# EAGLE design untitled (EAGLE 7.7.0)
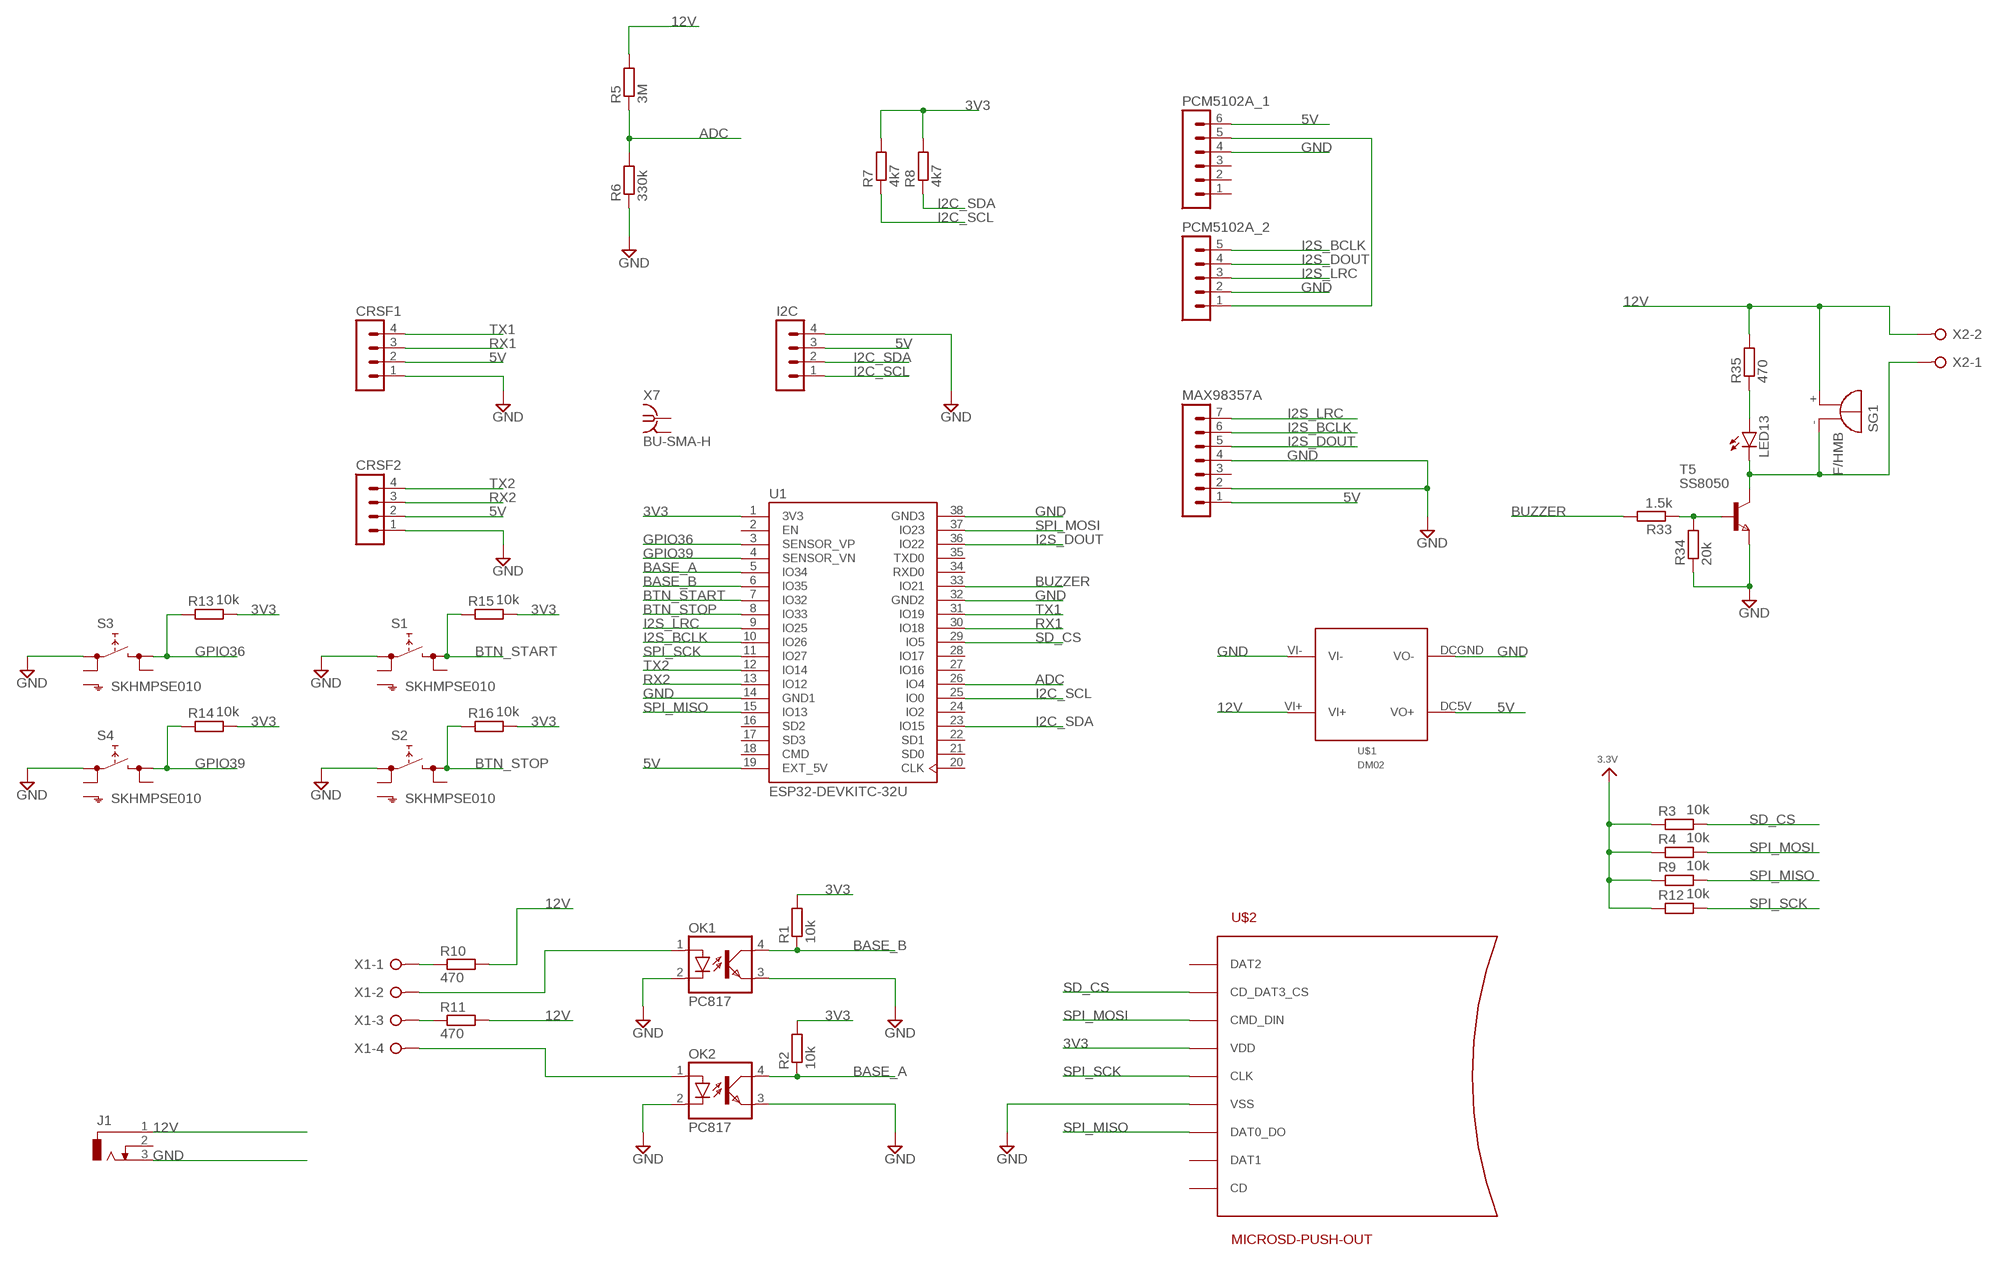
[diagram p0: schematic, sheet 1]

## Parts
CRSF1  MA04-1  [MA04-1]
CRSF2  MA04-1  [MA04-1]
I2C  MA04-1  [MA04-1]
J1  DCJ0303  [DCJ0303]
LED13  LEDCHIPLED_0805  [CHIPLED_0805]
MAX98357A  MA07-1  [MA07-1]
OK1  PC817  [DIL04]
OK2  PC817  [DIL04]
PCM5102A_1  MA06-1  [MA06-1]
PCM5102A_2  MA05-1  [MA05-1]
R1  10k  R-EU_R0603  [R0603]
R2  10k  R-EU_R0603  [R0603]
R3  10k  R-EU_R0603  [R0603]
R4  10k  R-EU_R0603  [R0603]
R5  3M  R-EU_R0603  [R0603]
R6  330k  R-EU_R0603  [R0603]
R7  4k7  R-EU_R0603  [R0603]
R8  4k7  R-EU_R0603  [R0603]
R9  10k  R-EU_R0603  [R0603]
R10  470  R-EU_R0603  [R0603]
R11  470  R-EU_R0603  [R0603]
R12  10k  R-EU_R0603  [R0603]
R13  10k  R-EU_R0603  [R0603]
R14  10k  R-EU_R0603  [R0603]
R15  10k  R-EU_R0603  [R0603]
R16  10k  R-EU_R0603  [R0603]
R33  1.5k  R-EU_R0603  [R0603]
R34  20k  R-EU_R0603  [R0603]
R35  470  R-EU_R0603  [R0603]
S1  SKHMPSE010  [SKHMPXE010]
S2  SKHMPSE010  [SKHMPXE010]
S3  SKHMPSE010  [SKHMPXE010]
S4  SKHMPSE010  [SKHMPXE010]
SG1  F/HMB  [F/HMB]
T5  SS8050  NPNSOT23  [SOT-23]
U1  ESP32-DEVKITC-32U  [MODULE_ESP32-DEVKITC-32U]
U$1  DM02  [DM02]
U$2  MICROSD-PUSH-OUT  [MICROSD-PUSH-OUT]
X1  W237-04P  [W237-4P]
X2  W237-02P  [W237-132]
X7  BU-SMA-H  [BU-SMA-H]

## Nets
3.3V: R3.1 R4.1 R9.1 R12.1
3V3: R1.2 R2.2 R7.2 R8.2 R13.2 R14.2 R15.2 R16.2 U1.1(3V3) U$2.4(VDD)
5V: CRSF1.2 CRSF2.2 I2C.3 MAX98357A.1 PCM5102A_1.6 U1.19(EXT_5V) U$1.DC5V(VO+)
12V: J1.1 R5.2 R10.2 R11.2 R35.2 SG1.+ U$1.VI+ X2.2
ADC: R5.1 R6.2 U1.26(IO4)
BASE_A: OK2.4(COL) R2.1 U1.5(IO34)
BASE_B: OK1.4(COL) R1.1 U1.6(IO35)
BTN_START: R15.1 S1.3(2.1) U1.7(IO32)
BTN_STOP: R16.1 S2.3(2.1) U1.8(IO33)
BUZZER: R33.2 U1.33(IO21)
GND: CRSF1.1 CRSF2.1 I2C.4 J1.3 MAX98357A.2 MAX98357A.4 OK1.2(C) OK1.3(EMIT) OK2.2(C) OK2.3(EMIT) PCM5102A_1.4 PCM5102A_2.2 R6.1 R34.1 S1.1(1.1) S2.1(1.1) S3.1(1.1) S4.1(1.1) T5.2(E) U1.14(GND1) U1.32(GND2) U1.38(GND3) U$1.DCGND(VO-) U$1.VI- U$2.6(VSS) U$2.G1(VSS) U$2.G2(VSS) U$2.G3(VSS) U$2.G4(VSS)
GPIO36: R13.1 S3.3(2.1) U1.3(SENSOR_VP)
GPIO39: R14.1 S4.3(2.1) U1.4(SENSOR_VN)
I2C_SCL: I2C.1 R7.1 U1.25(IO0)
I2C_SDA: I2C.2 R8.1 U1.23(IO15)
I2S_BCLK: MAX98357A.6 PCM5102A_2.5 U1.10(IO26)
I2S_DOUT: MAX98357A.5 PCM5102A_2.4 U1.36(IO22)
I2S_LRC: MAX98357A.7 PCM5102A_2.3 U1.9(IO25)
N$1: OK1.1(A) X1.2
N$2: OK2.1(A) X1.4
N$3: PCM5102A_1.5 PCM5102A_2.1
N$24: R10.1 X1.1
N$30: R11.1 X1.3
N$59: R33.1 R34.2 T5.3(B)
N$61: LED13.A R35.1
N$62: LED13.C SG1.- T5.1(C) X2.1
RX1: CRSF1.3 U1.30(IO18)
RX2: CRSF2.3 U1.13(IO12)
SD_CS: R3.2 U1.29(IO5) U$2.2(CD_DAT3_CS)
SPI_MISO: R9.2 U1.15(IO13) U$2.7(DAT0_DO)
SPI_MOSI: R4.2 U1.37(IO23) U$2.3(CMD_DIN)
SPI_SCK: R12.2 U1.11(IO27) U$2.5(CLK)
TX1: CRSF1.4 U1.31(IO19)
TX2: CRSF2.4 U1.12(IO14)
Unconnected: J1.2 MAX98357A.3 PCM5102A_1.1 PCM5102A_1.2 PCM5102A_1.3 S1.2(1.2) S1.4(2.2) S1.5(SH) S2.2(1.2) S2.4(2.2) S2.5(SH) S3.2(1.2) S3.4(2.2) S3.5(SH) S4.2(1.2) S4.4(2.2) S4.5(SH) U1.2(EN) U1.16(SD2) U1.17(SD3) U1.18(CMD) U1.20(CLK) U1.21(SD0) U1.22(SD1) U1.24(IO2) U1.27(IO16) U1.28(IO17) U1.34(RXD0) U1.35(TXD0) U$2.1(DAT2) U$2.8(DAT1) U$2.CD X7.1 X7.2 X7.3 X7.4 X7.5

## Library data of the parts
CRSF1 CRSF2 I2C = con-lstb:MA04-1: PIN HEADER; OC_FARNELL: unknown; OC_NEWARK: unknown
J1 = con-jack:DCJ0303: DC POWER JACK Source: DCJ0303.pdf; OC_FARNELL: unknown; OC_NEWARK: unknown
LED13 = led:LED: LED OSRAM: - CHIPLED LG R971, LG N971, LY N971, LG Q971, LY Q971, LO R971, LY R971 LH N974, LH R974 LS Q976, LO Q976, LY Q976 LO Q996 - Hyper CHIPLED LW Q18S LB Q993, LB Q99A, LB R99A - SideLED LS A670, LO A670, LY A670, LG A670, LP A670 LB A673, LV A673, LT A673, LW A673 LH A674 LY A675 LS A676, LA A676, LO A676, LY A676, LW A676 LS A679, LY A679, LG A679 - Hyper Micro SIDELED® LS Y876, LA Y876, LO Y876, LY Y876 LT Y87S - SmartLED LW L88C, LW L88S LB L89C, LB L89S, LG L890 LS L89K, LO L89K, LY L89K LS L896, LA L896, LO L896, LY L896 - TOPLED LS T670, LO T670, LY T670, LG T670, LP T670 LSG T670, LSP T670, LSY T670, LOP T670, LYG T670 LG T671, LOG T671, LSG T671 LB T673, LV T673, LT T673, LW T673 LH T674 LS T676, LA T676, LO T676, LY T676, LB T676, LH T676, LSB T676, LW T676 LB T67C, LV T67C, LT T67C, LS T67K, LO T67K, LY T67K, LW E67C LS E67B, LA E67B, LO E67B, LY E67B, LB E67C, LV E67C, LT E67C LW T67C LS T679, LY T679, LG T679 LS T770, LO T770, LY T770, LG T770, LP T770 LB T773, LV T773, LT T773, LW T773 LH T774 LS E675, LA E675, LY E675, LS T675 LS T776, LA T776, LO T776, LY T776, LB T776 LHGB T686 LT T68C, LB T68C - Hyper Mini TOPLED® LB M676 - Mini TOPLED Santana® LG M470 LS M47K, LO M47K, LY M47K Source: http://www.osram.convergy.de LUXEON: - LUMILED® LXK2-PW12-R00, LXK2-PW12-S00, LXK2-PW14-U00, LXK2-PW14-V00 LXK2-PM12-R00, LXK2-PM12-S00, LXK2-PM14-U00 LXK2-PE12-Q00, LXK2-PE12-R00, LXK2-PE12-S00, LXK2-PE14-T00, LXK2-PE14-U00 LXK2-PB12-K00, LXK2-PB12-L00, LXK2-PB12-M00, LXK2-PB14-N00, LXK2-PB14-P00, LXK2-PB14-Q00 LXK2-PR12-L00, LXK2-PR12-M00, LXK2-PR14-Q00, LXK2-PR14-R00 LXK2-PD12-Q00, LXK2-PD12-R00, LXK2-PD12-S00 LXK2-PH12-R00, LXK2-PH12-S00 LXK2-PL12-P00, LXK2-PL12-Q00, LXK2-PL12-R00 Source: www.luxeon.com KINGBRIGHT: KA-3528ASYC Source: www.kingbright.com
MAX98357A = con-lstb:MA07-1: PIN HEADER; OC_FARNELL: unknown; OC_NEWARK: unknown
OK1 OK2 = optocoupler:PC817: SHARP OPTO COUPLER; MPN: PC817X4J000F; OC_FARNELL: 9707727; OC_NEWARK: 97K7059
PCM5102A_1 = con-lstb:MA06-1: PIN HEADER; OC_FARNELL: unknown; OC_NEWARK: unknown
PCM5102A_2 = con-lstb:MA05-1: PIN HEADER; OC_FARNELL: unknown; OC_NEWARK: unknown
R1-R16 R33-R35 = rcl:R-EU_: RESISTOR, European symbol; SPICEPREFIX: R
S1-S4 = switch:SKHMP*E010: 6.2 X 6.5mm TACT Switch (SMD) Source: http://www3.alps.co.jp/WebObjects/catalog.woa/PDF/E/Switch/Tact/SKHM/SKHM.PDF
SG1 = buzzer:F/HMB: BUZZER Source: Buerklin; OC_FARNELL: unknown; OC_NEWARK: unknown
T5 = zetex:NPNSOT23: NPN TRANSISTOR; MPN: DSS20201L-7; OC_FARNELL: 1710688; OC_NEWARK: 25R4555
U1 = ESP32-DEVKITC-32U:ESP32-DEVKITC-32U: Check availability <https://pricing.snapeda.com/parts/ESP32-DEVKITC-32U/Espressif%20Systems/view-part?ref=eda>; AVAILABILITY: In Stock; CHECK_PRICES: https://www.snapeda.com/parts/ESP32-DEVKITC-32U/Espressif+Systems/view-part/?ref=eda; DESCRIPTION: ESP32-WROOM-32UE series Transceiver; 802.11 b/g/n (Wi-Fi, WiFi, WLAN), Bluetooth® Smart Ready 4.x Dual Mode Evaluation Board; MF: Espressif Systems; MP: ESP32-DEVKITC-32U; PACKAGE: CUSTOM-38 ESPRESSIF; PRICE: None; SNAPEDA_LINK: https://www.snapeda.com/parts/ESP32-DEVKITC-32U/Espressif+Systems/view-part/?ref=snap
U$1 = dm02:DM02
U$2 = microsd:MICROSD-PUSH-OUT: T-Flash Push-Out Micro SD Card Reader 14.75mm x 14.5mm SMD with external pins
X1 = con-wago-508:W237-04P: WAGO SREW CLAMP; OC_FARNELL: unknown; OC_NEWARK: unknown
X2 = con-wago-508:W237-02P: WAGO SREW CLAMP; OC_FARNELL: unknown; OC_NEWARK: unknown
X7 = con-coax:BU-SMA-H: FEMALE SMA CONNECTOR Radiall; OC_FARNELL: unknown; OC_NEWARK: unknown

## Board
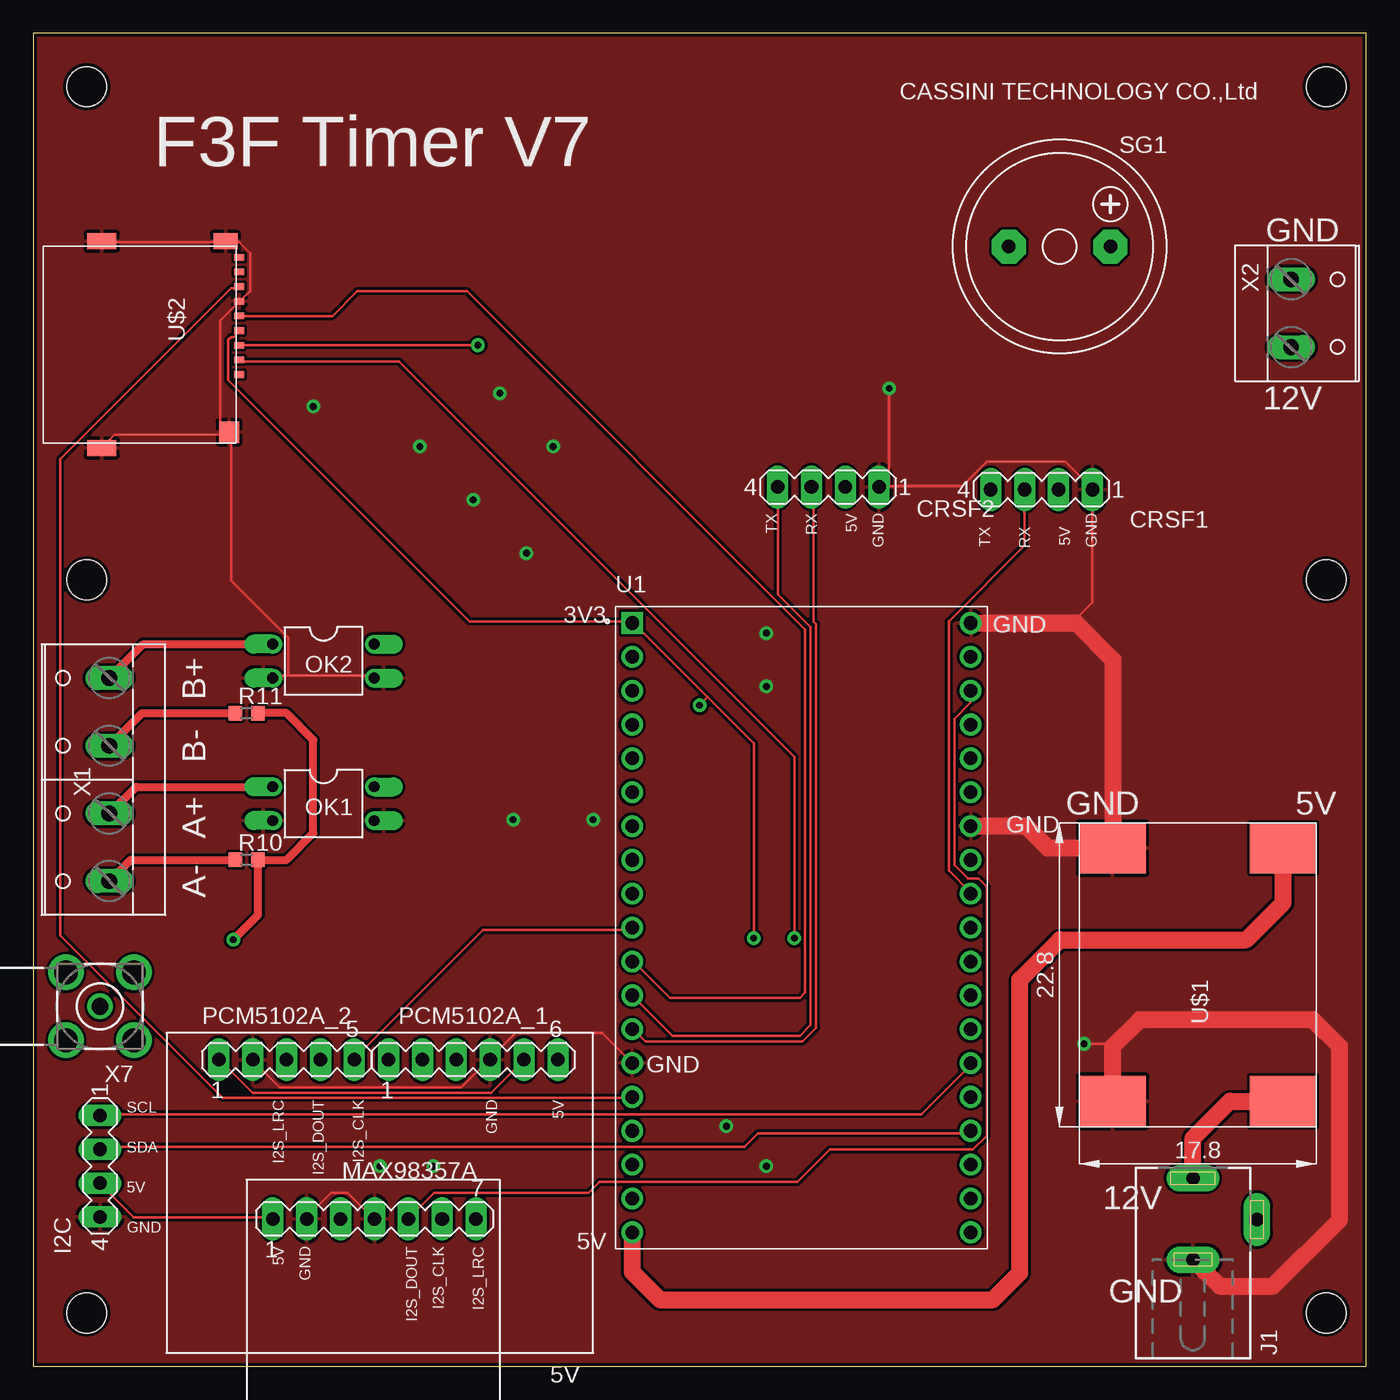
[diagram p1: board, top side]
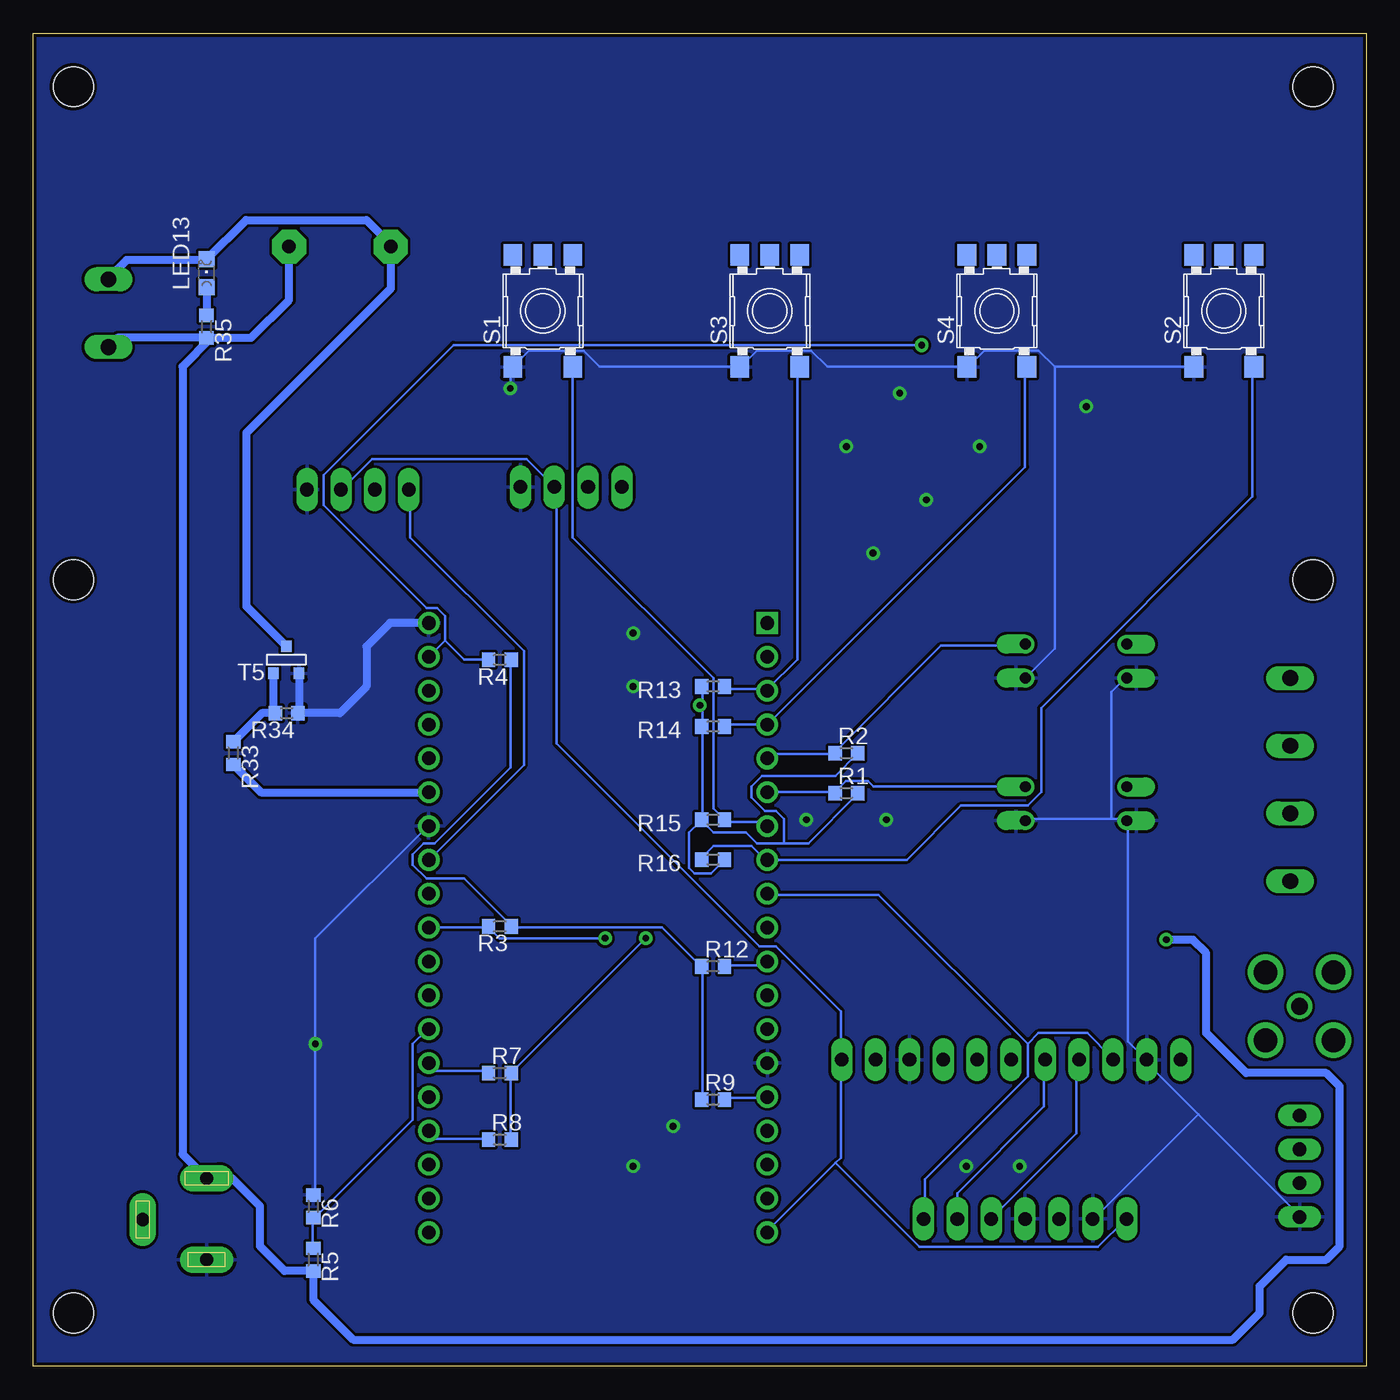
[diagram p2: board, bottom side, seen from below]

Size 100 x 100 mm. Coordinates in mm from the lower left corner, seen from the top.
Outline: 0,0 100,0 100,100 0,100 0,0
Copper layers (1*16): Top 0.035mm / dielectric 1.5mm / Bottom 0.035mm
Design rules "SparkFun": minimum track width 8mil, minimum drill 20mil, track to track 8mil, track to pad 8mil, pad to pad 8mil, via to via 8mil, smd to smd 8mil, copper to edge 10mil, drill to drill 8mil, minimum pad ring 12mil, minimum via ring 10mil, stop-mask expansion 4mil, vias tented up to drill 25mil, thermal gap 10mil
Holes 3 mm at 4,4 97,4 4,96 97,96 97,59 4,59

### Footprints (pad centres in the part's own frame; a part is rotated, then mirrored left to right if it is on the bottom)
MA04-1 = drill 1.016 long: 1 -3.81,0; 2 -1.27,0; 3 1.27,0; 4 3.81,0
DCJ0303 = drill 1 pad 2 long: 1 0,3.1; 2 4.8,0; 3 0,-3
CHIPLED_0805 = smd 1.2 x 1.2: A 0,-1.05; C 0,1.05
MA07-1 = drill 1.016 long: 1 -7.62,0; 2 -5.08,0; 3 -2.54,0; 4 0,0; 5 2.54,0; 6 5.08,0; 7 7.62,0
DIL04 = drill 0.813 offset: 1 -1.27,-3.81; 2 1.27,-3.81; 3 1.27,3.81; 4 -1.27,3.81
MA06-1 = drill 1.016 long: 1 -6.35,0; 2 -3.81,0; 3 -1.27,0; 4 1.27,0; 5 3.81,0; 6 6.35,0
MA05-1 = drill 1.016 long: 1 -5.08,0; 2 -2.54,0; 3 0,0; 4 2.54,0; 5 5.08,0
R0603 = smd 1 x 1.1: 1 -0.85,0; 2 0.85,0
SKHMPXE010 = smd 1.6 x 1.4: 1 -4.2,2.25; 2 4.2,2.25; 3 -4.2,-2.25; 4 4.2,-2.25; 5 4.2,0
F/HMB = drill 1.016 pad 2.54 octagon: + 3.81,0; - -3.81,0
SOT-23 = smd 0.787 x 0.889: 1 0.025,-1.016; 2 -0.94,1.016; 3 0.991,1.016
MODULE_ESP32-DEVKITC-32U = drill 1.02 square: 1 -12.7,22.85 | drill 1.02: 2 -12.7,20.31; 3 -12.7,17.77; 4 -12.7,15.23; 5 -12.7,12.69; 6 -12.7,10.15; 7 -12.7,7.61; 8 -12.7,5.07; 9 -12.7,2.53; 10 -12.7,-0.01; 11 -12.7,-2.55; 12 -12.7,-5.09; 13 -12.7,-7.63; 14 -12.7,-10.17; 15 -12.7,-12.71; 16 -12.7,-15.25; 17 -12.7,-17.79; 18 -12.7,-20.33; 19 -12.7,-22.87; 20 12.7,-22.87; 21 12.7,-20.33; 22 12.7,-17.79; 23 12.7,-15.25; 24 12.7,-12.71; 25 12.7,-10.17; 26 12.7,-7.63; 27 12.7,-5.09; 28 12.7,-2.55; 29 12.7,-0.01; 30 12.7,2.53; 31 12.7,5.07; 32 12.7,7.61; 33 12.7,10.15; 34 12.7,12.69; 35 12.7,15.23; 36 12.7,17.77; 37 12.7,20.31; 38 12.7,22.85
DM02 = smd 3.8 x 5: DC5V 20.9,-15.3; DCGND 20.9,-2.5; VI+ 1.9,-15.3; VI- 1.9,-2.5
MICROSD-PUSH-OUT = smd 0.5 x 0.75: 1 9.625,0.225; 2 8.525,0.225; 3 7.425,0.225; 4 6.325,0.225; 5 5.225,0.225; 6 4.125,0.225; 7 3.025,0.225; 8 1.925,0.225; CD 0.825,0.225 | smd 1.2 x 1.8: G1 -0.375,-0.8 | smd 1.2 x 2.2: G2 -0.375,-10.1; G4 15.125,-10.1 | smd 1.6 x 1.5: G3 13.95,-0.55
W237-4P = drill 1.194 long: 1 -7.62,-0.635; 2 -2.54,-0.635; 3 2.54,-0.635; 4 7.62,-0.635
W237-132 = drill 1.194 long: 1 -2.54,-0.635; 2 2.54,-0.635
BU-SMA-H = drill 1.27: 1 0,0 | drill 1.778: 2 -2.55,2.55; 3 2.55,2.55; 4 2.55,-2.55; 5 -2.55,-2.55

### Placement (x,y rotation side)
CRSF1  75.65,65.77 180 top
CRSF2  59.65,65.96 180 top
I2C  5,15 270 top
J1  87,11 0 top
LED13  87,82 0 bottom
MAX98357A  25.59,11.05 0 top
OK1  21.77,42.2 270 top
OK2  21.77,52.9 270 top
PCM5102A_1  33,23 0 top
PCM5102A_2  19,23 0 top
R1  39,43 0 bottom
R2  39,46 0 bottom
R3  65,33 180 bottom
R4  65,53 180 bottom
R5  79,8 270 bottom
R6  79,12 270 bottom
R7  65,22 0 bottom
R8  65,17 0 bottom
R9  49,20 0 bottom
R10  16,38 0 top
R11  16,49 0 top
R12  49,30 0 bottom
R13  49,51 180 bottom
R14  49,48 180 bottom
R15  49,41 180 bottom
R16  49,38 0 bottom
R33  85,46 270 bottom
R34  81,49 180 bottom
R35  87,78 270 bottom
S1  61.77,79.17 90 bottom
S2  10.68,79.17 90 bottom
S3  44.74,79.17 90 bottom
S4  27.71,79.17 90 bottom
SG1  77,84 0 top
T5  81,53 180 bottom
U1  57.63,32.91 0 top
U$1  78.47,17.97 90 top
U$2  15.23,84.02 270 top
X1  5.07,44.01 90 top
X2  95,79 270 top
X7  5,27 180 top

### Tracks (layer width: path | path; a pad name or v marks a point on that pad's centre or on a via)
3.3V
  Bottom 0.203: R9.1 49.78,20.12 49.78,29.87 R12.1 49.99,30.07 52.83,32.92 64.01,32.92 R3.1 64.21,33.12 67.67,36.58 70.51,36.58 71.53,37.59 71.53,38.41 70.71,39.22 69.9,39.22 64.21,44.91 64.21,52.83 R4.1
3V3  (via drill 0.51)
  Top 0.203: U$2.4 15.44,77.62 15.04,77.22 14.83,77.22 14.63,77.01 14.63,73.97 32.72,55.88 44.91,55.88 U1.1 45.11,55.68 50.6,50.19 | v54.05,32.11 54.05,46.74 50.6,50.19 | 50.6,50.19 v49.99,49.58
  Bottom 0.203: 49.78,49.58 49.78,50.8 R13.2 | 49.78,49.58 49.78,48.16 R14.2 49.78,47.95 49.78,41.05 R15.2 | R16.2 49.17,36.98 50.39,36.98 50.8,37.39 50.8,40.03 49.99,40.84 R15.2 | 43.69,39.22 45.72,39.22 46.53,40.03 48.97,40.03 49.78,40.84 R15.2 | 43.69,39.22 41.86,39.22 38.2,42.88 R1.2 | 43.69,39.22 43.69,41.05 44.3,41.66 45.11,41.66 46.13,42.67 46.13,43.48 45.31,44.3 39.83,44.3 38.2,45.92 R2.2 | R8.2 64.21,17.07 64.21,21.95 R7.2 64.01,22.15 v54.05,32.11 | v49.99,49.58 49.78,49.58
5V
  Top 0.203: MAX98357A.1 17.88,11.18 7.52,11.18 5.08,13.61 I2C.3
  Top 1.27: U1.19 44.93,7.07 47,5 72,5 74,7 74,29 77,32 91,32 93.77,34.77 U$1.DC5V
  Bottom 0.203: CRSF1.2 76.81,65.84 74.57,68.07 62.99,68.07 60.96,66.04 CRSF2.2 60.76,65.84 60.76,46.74 45.52,31.5 44.3,31.5 39.42,26.62 39.42,23.16 PCM5102A_1.6 39.42,22.96 39.42,15.65 39.83,15.24 | 39.83,15.24 44.91,10.16 U1.19 | 39.83,15.24 33.53,8.94 20.12,8.94 18.09,10.97 MAX98357A.1
12V  (via drill 0.51)
  Top 0.61: v15,32 16.85,33.85 R10.2 19,38 21,40 21,47 19,49 R11.2
  Top 1.27: J1.1 87,17.1 89.77,19.87 U$1.VI+
  Bottom 0.61: 86.66,77.15 88.81,75 88.81,15.91 J1.1 85.1,14.1 83,12 83,9 81.15,7.15 R5.2 79,5 76,2 10,2 8,4 8,6 6,8 3,8 2,9 2,21 3,22 9,22 12,25 12,31 13,32 v15,32 | 86.66,77.15 R35.2 93.67,77.15 X2.2 | 86.66,77.15 83.66,77.15 80.81,80 SG1.+
ADC
  Bottom 0.203: R5.1 79.05,8.94 79.05,10.97 R6.2 78.84,11.18 71.53,18.49 71.53,24.18 70.51,25.2 U1.26
BASE_A
  Bottom 0.203: U1.5 44.91,45.72 44.7,45.92 40.03,45.92 R2.1 39.83,46.13 31.9,54.05 25.6,54.05 OK2.4
BASE_B
  Bottom 0.203: U1.6 44.91,43.08 40.03,43.08 R1.1 39.83,43.08 39.01,43.89 37.39,43.89 36.98,43.48 25.6,43.48 OK1.4
BTN_START
  Bottom 0.203: U1.7 45.11,40.64 45.31,40.84 47.95,40.84 R15.1 48.16,41.05 48.97,41.86 48.97,51.61 59.54,62.18 59.54,74.78 S1.3
BTN_STOP
  Bottom 0.203: R16.1 49.78,38.2 48.97,39.01 46.13,39.01 45.11,38 U1.8 44.91,38 34.47,38 30.41,42.06 25.4,42.06 24.38,43.08 24.38,49.38 8.53,65.23 8.53,74.78 S2.3
BUZZER
  Bottom 0.61: R33.2 82.91,43.06 U1.33
GND  (via drill 0.51)
  Top 0.203: 78.24,55.76 78.44,56.29 79.45,57.3 79.45,65.63 CRSF1.1 79.45,65.84 77.42,67.87 71.53,67.87 69.7,66.04 64.21,66.04 | 64.21,66.04 63.6,66.04 CRSF2.1 64.21,66.04 | v78.84,24.18 80.47,24.18 80.97,23.97 | 14.02,69.9 6.1,69.9 5.28,69.09 U$2.G4 | 14.02,69.9 14.63,69.9 U$2.G3 | U$2.G2 5.28,84.33 14.43,84.33 U$2.G1 14.63,84.33 15.44,84.33 16.26,83.52 16.26,80.67 15.65,80.06 U$2.6 15.44,79.86 14.02,78.44 14.02,69.9 | 14.02,69.9 U$2.G3 | 19.1,51.82 25.4,51.82 OK2.3 | 19.1,51.82 18.09,51.82 OK2.2 | U1.14 44.91,22.76 42.67,24.99 36.17,24.99 34.34,23.16 PCM5102A_1.4 34.14,22.96 32.11,20.93 18.49,20.93 16.46,22.96 PCM5102A_2.2 | MAX98357A.2 20.52,11.18 22.35,13.01 23.57,13.01 25.4,11.18 MAX98357A.4 | 19.1,51.82 19.1,54.66 14.83,58.93 14.83,69.9 U$2.G3 | v64.21,73.36 64.21,66.04
  Top 1.27: J1.3 89,6 93,6 98,11 98,24 96,26 83,26 80.97,23.97 U$1.VI- | U1.38 78.24,55.76 81,53 81,38.9 U$1.DCGND 76.13,38.87 74.48,40.52 U1.32
  Bottom 0.203: R6.1 78.84,13.01 v78.84,24.18 78.84,32.11 70.51,40.44 U1.32 | 23.37,74.98 13.01,74.98 S2.1 | 23.37,74.98 24.59,76.2 28.65,76.2 29.87,74.98 S4.1 30.07,74.98 40.44,74.98 41.66,76.2 45.72,76.2 46.94,74.98 S3.1 47.14,74.98 57.51,74.98 58.73,76.2 62.79,76.2 64.01,74.98 S1.1 64.21,74.78 v64.21,73.36 | 19.1,41.05 25.4,41.05 OK1.3 | 19.1,41.05 18.09,41.05 OK1.2 17.88,40.84 17.88,24.38 16.66,23.16 PCM5102A_2.2 16.66,22.96 12.6,18.9 | 19.1,41.05 19.1,50.6 18.09,51.61 OK2.2 | 12.6,18.9 5.08,11.38 I2C.4 | 12.6,18.9 20.32,11.18 MAX98357A.2 | 23.37,74.98 23.37,53.85 25.4,51.82 OK2.3
  Bottom 0.61: T5.2 80.06,49.09 R34.1 77,49 75,51 75,54 73.24,55.76 U1.38
  other vias: 37,61 33,65 29,69 21,72 35,73 39,69 55,15 52,18 30,15 26,15 55,55 55,51 42,41 36,41
  pour Top: -1,101 102,101 102,-2 -1,-2
  pour Bottom: -3,102 103,102 103,-3 -2,-3 -2,101
GPIO36
  Bottom 0.203: R13.1 47.95,50.8 45.11,50.8 U1.3 44.91,50.8 42.67,53.03 42.67,74.78 S3.3
GPIO39
  Bottom 0.203: R14.1 47.95,48.16 45.11,48.16 U1.4 44.91,48.16 25.6,67.46 25.6,74.78 S4.3
I2C_SCL
  Top 0.203: I2C.1 5.08,18.9 66.65,18.9 70.31,22.55 U1.25
  Bottom 0.203: R7.1 66.04,22.15 69.9,22.15 70.31,22.55 U1.25
I2C_SDA
  Top 0.203: I2C.2 5.08,16.46 53.35,16.46 54.36,17.48 70.31,17.48 U1.23
  Bottom 0.203: R8.1 66.04,17.07 69.9,17.07 70.31,17.48 U1.23
I2S_BCLK
  Top 0.203: U1.10 44.91,32.72 33.73,32.72 24.18,23.16 PCM5102A_2.5
  Bottom 0.203: MAX98357A.6 30.67,12.99 24.18,19.48 24.18,22.96 PCM5102A_2.5
I2S_DOUT
  Top 0.203: U1.36 70.31,50.6 70.31,49.78 69.09,48.56 69.09,37.59 70.1,36.58 70.92,36.58 71.53,35.97 71.53,17.27 70.51,16.26 59.75,16.26 57.31,13.82 42.47,13.82 41.66,13.01 30.07,13.01 28.25,11.18 MAX98357A.5
  Bottom 0.203: PCM5102A_2.4 21.74,22.96 21.74,17.48 28.04,11.18 MAX98357A.5
I2S_LRC
  Bottom 0.203: 25.4,24.18 25.4,21.74 33.12,14.02 33.12,11.18 MAX98357A.7 | 25.4,24.18 24.59,24.99 20.93,24.99 19.1,23.16 PCM5102A_2.3 | 25.4,24.18 36.58,35.36 44.91,35.36 U1.9
N$1
  Top 0.61: X1.2 7.71,43.47 OK1.1
N$2
  Top 0.61: X1.4 8.24,54.17 OK2.1
N$3
  Top 0.203: PCM5102A_2.1 14.02,22.96 16.46,20.52 34.34,20.52 36.78,22.96 PCM5102A_1.5
N$24
  Top 0.61: X1.1 7.32,38 R10.1
N$30
  Top 0.61: X1.3 8.15,49 R11.1
N$59
  Bottom 0.61: T5.3 81.99,49.14 R34.2 82.85,49 R33.1
N$61
  Bottom 0.61: LED13.A R35.1
N$62
  Bottom 0.61: X2.1 94.36,81.64 93,83 87.05,83 LED13.C 84.05,86 75,86 73.19,84.19 SG1.- 73.19,80.85 84.03,70.02 84.03,57.02 T5.1
RX1
  Top 0.203: CRSF1.3 74.37,65.63 74.37,61.57 68.68,55.88 68.68,37.19 70.31,35.56 U1.30
RX2
  Top 0.203: CRSF2.3 58.52,65.84 58.52,55.88 58.73,55.68 58.73,25.4 57.71,24.38 45.92,24.38 45.11,25.2 U1.13
SD_CS  (via drill 0.51)
  Top 0.203: v57.1,32.11 57.1,45.72 27.43,75.39 15.65,75.39 U$2.2
  Bottom 0.203: v57.1,32.11 65.02,32.11 65.84,32.92 R3.2 66.04,32.92 70.31,32.92 U1.29
SPI_MISO
  Top 0.203: U$2.7 15.44,80.87 14.83,80.87 2.03,68.07 2.03,32.31 14.22,20.12 44.91,20.12 U1.15
  Bottom 0.203: R9.2 47.95,20.12 45.11,20.12 U1.15
SPI_MOSI  (via drill 0.51)
  Top 0.203: v33.36,76.61 15.65,76.61 U$2.3
  Bottom 0.203: v33.36,76.61 68.48,76.61 78.23,66.85 78.23,64.62 70.51,56.9 69.7,56.9 69.09,56.29 69.09,54.46 | 69.09,54.46 70.31,53.24 U1.37 | 69.09,54.46 67.67,53.03 66.04,53.03 R4.2
SPI_SCK
  Top 0.203: U$2.5 22.45,78.8 24.3,80.64 32.54,80.64 57.91,55.27 57.91,28.04 57.51,27.64 47.75,27.64 45.11,30.28 U1.11
  Bottom 0.203: R12.2 47.95,30.07 45.31,30.07 45.11,30.28 U1.11
TX1
  Bottom 0.203: CRSF1.4 71.73,65.63 71.73,62.18 63.2,53.65 63.2,45.11 70.31,38 U1.31
TX2
  Top 0.203: CRSF2.4 55.88,65.84 55.88,57.91 58.32,55.47 58.32,25.6 57.51,24.79 47.95,24.79 45.11,27.64 U1.12

### Text on the board
tPlace: CASSINI TECHNOLOGY CO.,Ltd | F3F Timer V7 | GND | 12V | TX | RX | 5V | GND | GND | TX | RX | 5V | 3V3 | GND | B+ | B- | A+ | GND | 5V | GND | A- | GND | I2S_LRC | I2S_DOUT | I2S_CLK | GND | 5V | SCL | SDA | 12V | 5V | GND | 5V | 5V | GND | I2S_DOUT | I2S_CLK | I2S_LRC | GND | 5V